# EAGLE schematic 4Конденсатор (EAGLE 9.4.2)

## Sheet 1 of 3
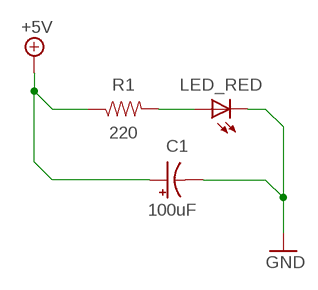
[diagram p0: schematic, sheet 1]

### Parts
C1  100uF  100UF-POLAR-RADIAL-2.5MM-25V-20%  [CPOL-RADIAL-2.5MM-6.5MM]
LED_RED  LED5MM  [LED5MM]
R1  220  100OHM-HORIZ-1/4W-1%  [AXIAL-0.3]

### Nets
+5V: C1.1(+) R1.P$1 ; also sheet 2,3
GND: C1.2(-) LED_RED.K(C) ; also sheet 2,3
N$7: LED_RED.A R1.P$2

## Sheet 2 of 3
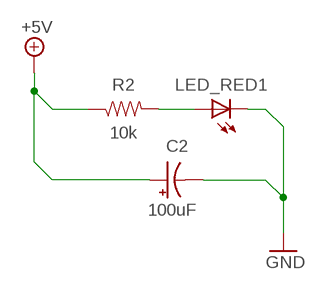
[diagram p1: schematic, sheet 2]

### Parts
C2  100uF  100UF-POLAR-RADIAL-2.5MM-25V-20%  [CPOL-RADIAL-2.5MM-6.5MM]
LED_RED1  LED5MM  [LED5MM]
R2  10k  100OHM-HORIZ-1/4W-1%  [AXIAL-0.3]

### Nets
+5V: C2.1(+) R2.P$1 ; also sheet 1,3
GND: C2.2(-) LED_RED1.K(C) ; also sheet 1,3
N$2: LED_RED1.A R2.P$2

## Sheet 3 of 3
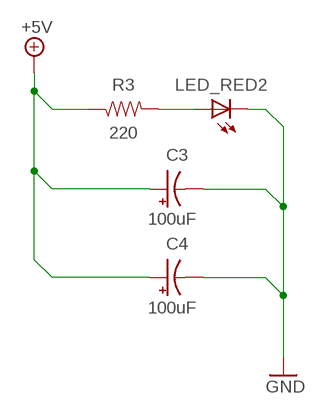
[diagram p2: schematic, sheet 3]

### Parts
C3  100uF  100UF-POLAR-RADIAL-2.5MM-25V-20%  [CPOL-RADIAL-2.5MM-6.5MM]
C4  100uF  100UF-POLAR-RADIAL-2.5MM-25V-20%  [CPOL-RADIAL-2.5MM-6.5MM]
LED_RED2  LED5MM  [LED5MM]
R3  220  100OHM-HORIZ-1/4W-1%  [AXIAL-0.3]

### Nets
+5V: C3.1(+) C4.1(+) R3.P$1 ; also sheet 1,2
GND: C3.2(-) C4.2(-) LED_RED2.K(C) ; also sheet 1,2
N$3: LED_RED2.A R3.P$2

## Library data of the parts
C1-C4 = SparkFun-Capacitors:100UF-POLAR: 100µF polarized capacitors A capacitor is a passive two-terminal electrical component used to store electrical energy temporarily in an electric field.; PROD_ID: CAP-08439
LED_RED LED_RED1 LED_RED2 = adafruit:LED: LED OSRAM: - CHIPLED LG R971, LG N971, LY N971, LG Q971, LY Q971, LO R971, LY R971 LH N974, LH R974 LS Q976, LO Q976, LY Q976 LO Q996 - Hyper CHIPLED LW Q18S LB Q993, LB Q99A, LB R99A - SideLED LS A670, LO A670, LY A670, LG A670, LP A670 LB A673, LV A673, LT A673, LW A673 LH A674 LY A675 LS A676, LA A676, LO A676, LY A676, LW A676 LS A679, LY A679, LG A679 - Hyper Micro SIDELED® LS Y876, LA Y876, LO Y876, LY Y876 LT Y87S - SmartLED LW L88C, LW L88S LB L89C, LB L89S, LG L890 LS L89K, LO L89K, LY L89K LS L896, LA L896, LO L896, LY L896 - TOPLED LS T670, LO T670, LY T670, LG T670, LP T670 LSG T670, LSP T670, LSY T670, LOP T670, LYG T670 LG T671, LOG T671, LSG T671 LB T673, LV T673, LT T673, LW T673 LH T674 LS T676, LA T676, LO T676, LY T676, LB T676, LH T676, LSB T676, LW T676 LB T67C, LV T67C, LT T67C, LS T67K, LO T67K, LY T67K, LW E67C LS E67B, LA E67B, LO E67B, LY E67B, LB E67C, LV E67C, LT E67C LW T67C LS T679, LY T679, LG T679 LS T770, LO T770, LY T770, LG T770, LP T770 LB T773, LV T773, LT T773, LW T773 LH T774 LS E675, LA E675, LY E675, LS T675 LS T776, LA T776, LO T776, LY T776, LB T776 LHGB T686 LT T68C, LB T68C - Hyper Mini TOPLED® LB M676 - Mini TOPLED Santana® LG M470 LS M47K, LO M47K, LY M47K Source: http://www.osram.convergy.de/
R1-R3 = SparkFun-Resistors:100OHM: 100Ω resistor A resistor is a passive two-terminal electrical component that implements electrical resistance as a circuit element. Resistors act to reduce current flow, and, at the same time, act to lower voltage levels within circuits. - Wikipedia; PROD_ID: RES-12181; VALUE: 100